# Altium project PCB_Assignment.PrjPcb
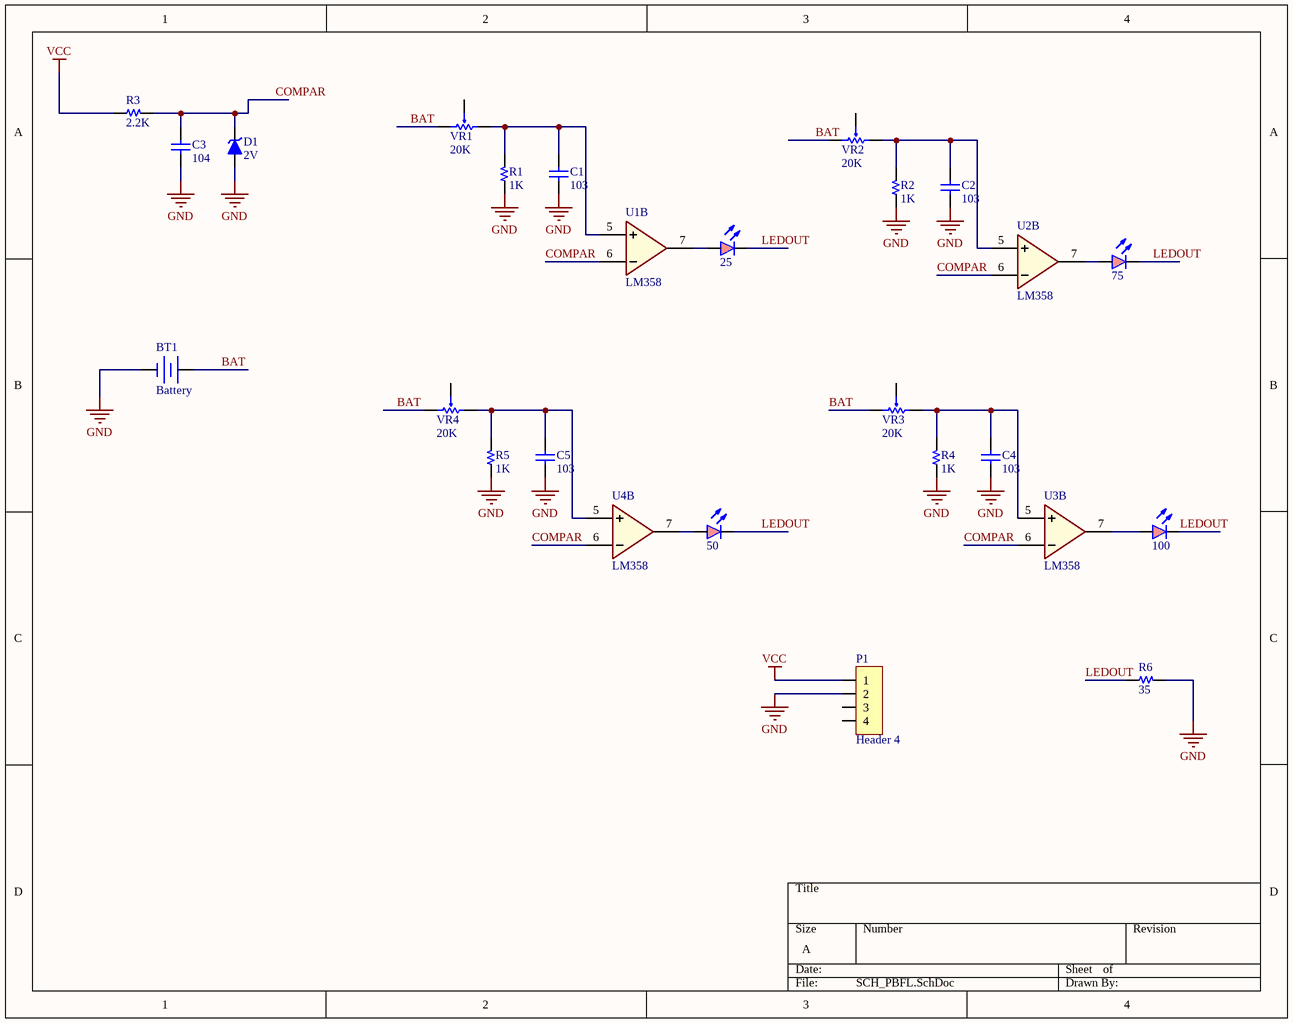
[diagram p0: SCH_PBFL.SchDoc]
1 sheet, 26 parts. Net scope: global (net labels, ports and power ports of the same name join across sheets).
Board file: PCB_PBFL.PcbDoc

## Sheet SCH_PBFL.SchDoc
size A; SheetNumber: 1; SheetTotal: 1

### Parts
25  LED RED  [LED 10MM - RED]  (value not drawn)
50  LED RED  [LED 10MM - RED]  (value not drawn)
75  LED RED  [LED 10MM - RED]  (value not drawn)
100  LED RED  [LED 10MM - RED]  (value not drawn)
BT1  Battery  [BB-BAT-18650-x1]
C1  103  [C 0805]
C2  103  [C 0805]
C3  104  [C 0805]
C4  103  [C 0805]
C5  103  [C 0805]
D1  2V  [SOD123]
P1  Header 4  [HDR/Header/4/BOX/RED]
R1  1K  [R 0805]
R2  1K  [R 0805]
R3  2.2K  [R 0805]
R4  1K  [R 0805]
R5  1K  [R 0805]
R6  35  [R 0805]
U1  LM358  [SOIC-8]  (part B of 2)
U2  LM358  [SOIC-8]  (part B of 2)
U3  LM358  [SOIC-8]  (part B of 2)
U4  LM358  [SOIC-8]  (part B of 2)
VR1  20K  [R VAR E]
VR2  20K  [R VAR E]
VR3  20K  [R VAR E]
VR4  20K  [R VAR E]

### Nets
GND: BT1.2(V-) C1.2 C2.2 C3.2 C4.2 C5.2 D1.1(A) P1.2 R1.1 R2.1 R4.1 R5.1 R6.2
VCC: P1.1 R3.1
BAT: BT1.1(V+) VR1.1 VR2.1 VR3.1 VR4.1
COMPAR: C3.1 D1.2(K) R3.2 U1.6(B-) U2.6(B-) U3.6(B-) U4.6(B-)
LEDOUT: 25.2(K) 50.2(K) 75.2(K) 100.2(K) R6.1
Net25_1: 25.1(A) U1.7(OutB)
Net50_1: 50.1(A) U4.7(OutB)
Net75_1: 75.1(A) U2.7(OutB)
Net100_1: 100.1(A) U3.7(OutB)
NetC1_1: C1.1 R1.2 U1.5(B+) VR1.3
NetC2_1: C2.1 R2.2 U2.5(B+) VR2.3
NetC4_1: C4.1 R4.2 U3.5(B+) VR3.3
NetC5_1: C5.1 R5.2 U4.5(B+) VR4.3

Not connected (* = marked no-connect by the designer): P1 3 4; VR1 2; VR2 2; VR3 2; VR4 2

### Library data of the parts
25 50 75 100 = LED RED: Typical LED 3-pin 2-color
C1-C5 = Capacitor NP: Capacitor non-pol
D1 = Diode Zener: Zener Diode
P1 = Header 4: Header, 4-Pin
R1-R6 = Resistor
U1-U4 = LM358: Low Power Dual Operational Amplifiers
VR1-VR4 = Resistor Variable